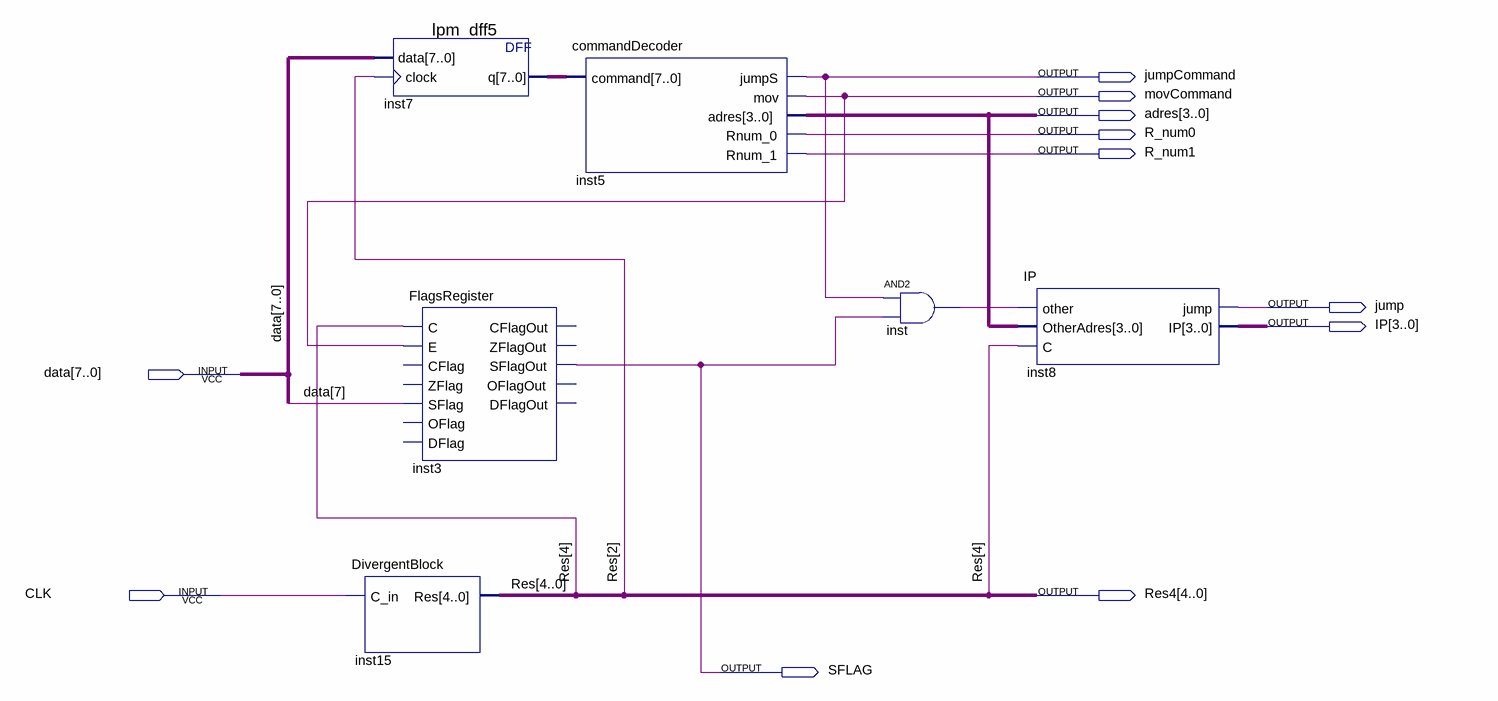
[diagram p0: schematic sheet]
// Quartus schematic Manage.bdf as structural Verilog: 6 symbols, 11 pins
module Manage (
  input  [7:0] data,
  input  CLK,
  output jumpCommand,
  output movCommand,
  output [3:0] adres,
  output R_num0,
  output R_num1,
  output jump,
  output [3:0] IP,
  output [4:0] Res4,
  output SFLAG
);

  wire inst_out;
  wire [7:0] inst7_q;

  lpm_dff5 inst7 (.data(data), .clock(Res4[2]), .q(inst7_q));
  DivergentBlock inst15 (.C_in(CLK), .Res(Res4));
  FlagsRegister inst3 (
    .C(Res4[4]), .E(movCommand), .SFlag(data[7]), .SFlagOut(SFLAG));  // open: CFlag, ZFlag, OFlag, DFlag, CFlagOut, ZFlagOut, OFlagOut, DFlagOut
  commandDecoder inst5 (
    .command(inst7_q), .jumpS(jumpCommand), .mov(movCommand), .adres(adres), .Rnum_0(R_num0), .Rnum_1(R_num1));
  and inst (inst_out, jumpCommand, SFLAG);
  IP inst8 (.other(inst_out), .OtherAdres(adres), .C(Res4[4]), .jump(jump), .IP(IP));

  // Other names for the same wires on the sheet: Res[4:0] = Res4
endmodule
